# EAGLE design Shruthi-Analog-dev (EAGLE 5.09)
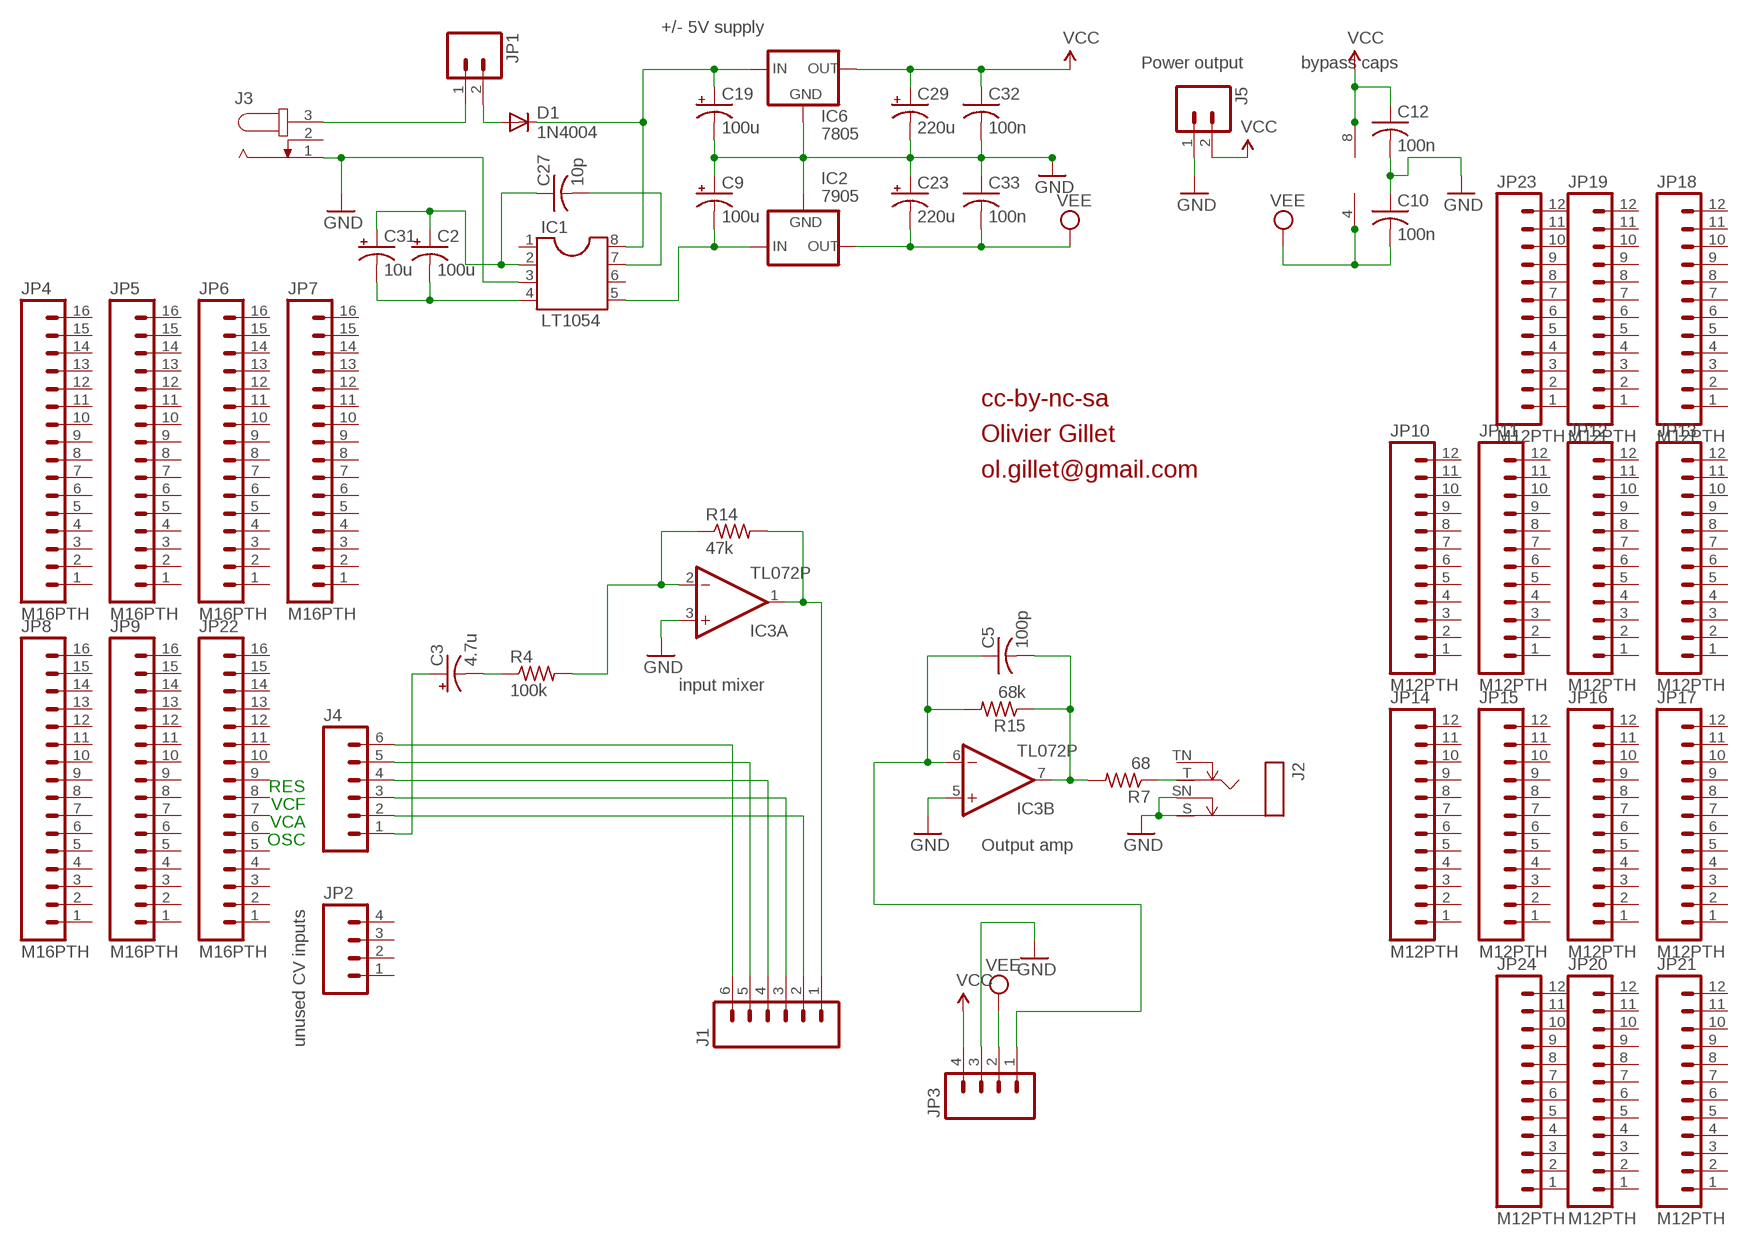
[diagram p0: schematic, sheet 1]

## Parts
C2  100u  CPOL-USE2.5-6  [E2,5-6]
C3  4.7u  CPOL-USE2.5-6  [E2,5-6]
C5  100p  C-US025-025X050  [C025-025X050]
C9  100u  CPOL-USE2.5-7  [E2,5-7]
C10  100n  C-US025-025X050  [C025-025X050]
C12  100n  C-US025-025X050  [C025-025X050]
C19  100u  CPOL-USE2.5-7  [E2,5-7]
C23  220u  CPOL-USE5-10.5  [E5-10,5]
C27  10p  C-US025-025X050  [C025-025X050]
C29  220u  CPOL-USE5-10.5  [E5-10,5]
C31  10u  CPOL-USE2.5-5  [E2,5-5]
C32  100n  C-US025-025X050  [C025-025X050]
C33  100n  C-US025-025X050  [C025-025X050]
D1  1N4004  [DO41-10]
IC1  LT1054  DIL8  [DIL08]
IC2  7905  79XXS  [79XXS]
IC3  TL072P  [DIL08]
IC6  7805  78XXS  [78XXS]
J1  M06SIP  [1X06]
J2  MONOSWS  [NMJ4HC-S]
J3  JACK-PLUG  [SPC4078_LARGER_HOLES]
J4  M06SIP  [1X06]
J5  M02PTH  [1X02]
JP1  M02  [1X02_LONGPADS]
JP2  M04PTH  [1X04]
JP3  M04PTH  [1X04]
JP4  M16PTH  [1X16]
JP5  M16PTH  [1X16]
JP6  M16PTH  [1X16]
JP7  M16PTH  [1X16]
JP8  M16PTH  [1X16]
JP9  M16PTH  [1X16]
JP10  M12PTH  [1X12]
JP11  M12PTH  [1X12]
JP12  M12PTH  [1X12]
JP13  M12PTH  [1X12]
JP14  M12PTH  [1X12]
JP15  M12PTH  [1X12]
JP16  M12PTH  [1X12]
JP17  M12PTH  [1X12]
JP18  M12PTH  [1X12]
JP19  M12PTH  [1X12]
JP20  M12PTH  [1X12]
JP21  M12PTH  [1X12]
JP22  M16PTH  [1X16]
JP23  M12PTH  [1X12]
JP24  M12PTH  [1X12]
R4  100k  R-US_0204/7  [0204/7]
R7  68  R-US_0204/7  [0204/7]
R14  47k  R-US_0204/7  [0204/7]
R15  68k  R-US_0204/7  [0204/7]

## Nets
GND: C9.+ C10.1 C12.2 C19.- C23.+ C29.- C32.2 C33.1 IC1.3 IC2.GND IC3.3(A:+IN) IC3.5(B:+IN) IC6.GND J2.S J2.SN J3.1 J5.1 JP3.3
N$1: C2.+ C27.1 C31.+ IC1.2
N$2: J1.5 J4.5
N$3: J3.3 JP1.1
N$4: C19.+ D1.C IC1.8 IC6.IN
N$5: C2.- C31.- IC1.4
N$6: J1.6 J4.6
N$7: J1.3 J4.3
N$22: IC3.1(A:OUT) J1.1 R14.2
N$35: C3.+ J4.1
N$36: C27.2 IC1.7
N$37: IC3.2(A:-IN) R4.2 R14.1
N$39: C3.- R4.1
N$45: J1.2 J4.2
N$47: J2.T R7.1
N$48: J1.4 J4.4
N$58: C9.- IC1.5 IC2.IN
N$59: D1.A JP1.2
N$63: C5.2 IC3.7(B:OUT) R7.2 R15.1
N$70: C5.1 IC3.6(B:-IN) JP3.1 R15.2
VCC: C12.1 C29.+ C32.1 IC3.8(P:V+) IC6.OUT J5.2 JP3.4
VEE: C10.2 C23.- C33.2 IC2.OUT IC3.4(P:V-) JP3.2
Unconnected: IC1.1 IC1.6 J2.TN J3.2 JP2.1 JP2.2 JP2.3 JP2.4 JP4.1 JP4.2 JP4.3 JP4.4 JP4.5 JP4.6 JP4.7 JP4.8 JP4.9 JP4.10 JP4.11 JP4.12 JP4.13 JP4.14 JP4.15 JP4.16 JP5.1 JP5.2 JP5.3 JP5.4 JP5.5 JP5.6 JP5.7 JP5.8 JP5.9 JP5.10 JP5.11 JP5.12 JP5.13 JP5.14 JP5.15 JP5.16 JP6.1 JP6.2 JP6.3 JP6.4 JP6.5 JP6.6 JP6.7 JP6.8 JP6.9 JP6.10 JP6.11 JP6.12 JP6.13 JP6.14 JP6.15 JP6.16 JP7.1 JP7.2 JP7.3 JP7.4 JP7.5 JP7.6 JP7.7 JP7.8 JP7.9 JP7.10 JP7.11 JP7.12 JP7.13 JP7.14 JP7.15 JP7.16 JP8.1 JP8.2 JP8.3 JP8.4 JP8.5 JP8.6 JP8.7 JP8.8 JP8.9 JP8.10 JP8.11 JP8.12 JP8.13 JP8.14 JP8.15 JP8.16 JP9.1 JP9.2 JP9.3 JP9.4 JP9.5 JP9.6 JP9.7 JP9.8 JP9.9 JP9.10 JP9.11 JP9.12 JP9.13 JP9.14 JP9.15 JP9.16 JP10.1 JP10.2 JP10.3 JP10.4 JP10.5 JP10.6 JP10.7 JP10.8 JP10.9 JP10.10 JP10.11 JP10.12 JP11.1 JP11.2 JP11.3 JP11.4 JP11.5 JP11.6 JP11.7 JP11.8 JP11.9 JP11.10 JP11.11 JP11.12 JP12.1 JP12.2 JP12.3 JP12.4 JP12.5 JP12.6 JP12.7 JP12.8 JP12.9 JP12.10 JP12.11 JP12.12 JP13.1 JP13.2 JP13.3 JP13.4 JP13.5 JP13.6 JP13.7 JP13.8 JP13.9 JP13.10 JP13.11 JP13.12 JP14.1 JP14.2 JP14.3 JP14.4 JP14.5 JP14.6 JP14.7 JP14.8 JP14.9 JP14.10 JP14.11 JP14.12 JP15.1 JP15.2 JP15.3 JP15.4 JP15.5 JP15.6 JP15.7 JP15.8 JP15.9 JP15.10 JP15.11 JP15.12 JP16.1 JP16.2 JP16.3 JP16.4 JP16.5 JP16.6 JP16.7 JP16.8 JP16.9 JP16.10 JP16.11 JP16.12 JP17.1 JP17.2 JP17.3 JP17.4 JP17.5 JP17.6 JP17.7 JP17.8 JP17.9 JP17.10 JP17.11 JP17.12 JP18.1 JP18.2 JP18.3 JP18.4 JP18.5 JP18.6 JP18.7 JP18.8 JP18.9 JP18.10 JP18.11 JP18.12 JP19.1 JP19.2 JP19.3 JP19.4 JP19.5 JP19.6 JP19.7 JP19.8 JP19.9 JP19.10 JP19.11 JP19.12 JP20.1 JP20.2 JP20.3 JP20.4 JP20.5 JP20.6 JP20.7 JP20.8 JP20.9 JP20.10 JP20.11 JP20.12 JP21.1 JP21.2 JP21.3 JP21.4 JP21.5 JP21.6 JP21.7 JP21.8 JP21.9 JP21.10 JP21.11 JP21.12 JP22.1 JP22.2 JP22.3 JP22.4 JP22.5 JP22.6 JP22.7 JP22.8 JP22.9 JP22.10 JP22.11 JP22.12 JP22.13 JP22.14 JP22.15 JP22.16 JP23.1 JP23.2 JP23.3 JP23.4 JP23.5 JP23.6 JP23.7 JP23.8 JP23.9 JP23.10 JP23.11 JP23.12 JP24.1 JP24.2 JP24.3 JP24.4 JP24.5 JP24.6 JP24.7 JP24.8 JP24.9 JP24.10 JP24.11 JP24.12

## Notes on the sheet
- +/- 5V supply
- Power output | bypass caps
- cc-by-nc-sa
- Olivier Gillet
- ol.gillet@gmail.com
- input mixer
- RES
- VCF
- VCA
- OSC
- Output amp
- unused CV inputs

## Library data of the parts
C2 C3 C9 C19 C23 C29 C31 = rcl:CPOL-US: POLARIZED CAPACITOR, American symbol
C5 C10 C12 C27 C32 C33 = rcl:C-US: CAPACITOR, American symbol
D1 = diode:1N4004: DIODE general purpose rectifier, 1 A
IC1 = ic-package:DIL8: Dual In Line / Socket
IC2 = v-reg:79XXS: VOLTAGE REGULATOR
IC3 = gm-ics:TL072: OP AMP
IC6 = v-reg:78XXS: VOLTAGE REGULATOR
J1 J4 = SparkFun:M06: Header 6 Standard 6-pin 0.1" header. Use with straight break away headers (SKU : PRT-00116), right angle break away headers (PRT-00553), swiss pins (PRT-00743), machine pins (PRT-00117), and female headers (PRT-00115). Molex polarized connector foot print use with SKU : PRT-08094 with associated crimp pins and housings. NOTES ON THE VARIANTS LOCK and LOCK_LONGPADS... This footprint was designed to help hold the alignment of a through-hole component (i.e. 6-pin header) while soldering it into place. You may notice that each hole has been shifted either up or down by 0.005 of an inch from it's more standard position (which is a perfectly straight line). This slight alteration caused the pins (the squares in the middle) to touch the edges of the holes. Because they are alternating, it causes a "brace" to hold the component in place. 0.005 has proven to be the perfect amount of "off-center" position when using our standard breakaway headers. Although looks a little odd when you look at the bare footprint, once you have a header in there, the alteration is very hard to notice. Also, if you push a header all the way into place, it is covered up entirely on the bottom side. This idea of altering the position of holes to aid alignment will be further integrated into the Sparkfun Library for other footprints. It can help hold any component with 3 or more connection pins.
J2 = gm-jacks:MONOSW
J3 = con-jack2:JACK-PLUG: DC POWER JACK Power Jack, DC, Right Angle, Through Hole, Rated 5A at 16VDC, PC Terminals Distributor: Farnell (www.Farnell.de) Drawing: 84N1161.pdf / 84N1162.pdf Manufacturer: SPC Technology (www.spctechnology.com) Type: SPC4077 / SPC 4078
J5 JP1 = SparkFun:M02: Header 2 Standard 2-pin 0.1" header. Use with straight break away headers (SKU : PRT-00116), right angle break away headers (PRT-00553), swiss pins (PRT-00743), machine pins (PRT-00117), and female headers (PRT-00115). Molex polarized connector foot print use with SKU : PRT-08233 with associated crimp pins and housings.
JP2 JP3 = SparkFun:M04: Header 4 Standard 4-pin 0.1" header. Use with straight break away headers (SKU : PRT-00116), right angle break away headers (PRT-00553), swiss pins (PRT-00743), machine pins (PRT-00117), and female headers (PRT-00115). Molex polarized connector foot print use with SKU : PRT-08231 with associated crimp pins and housings.
JP4-JP9 JP22 = SparkFun:M16
JP10-JP21 JP23 JP24 = SparkFun:M12: Header 12 Standard 12-pin 0.1" header. Use with straight break away headers (SKU : PRT-00116), right angle break away headers (PRT-00553), swiss pins (PRT-00743), machine pins (PRT-00117), and female headers (PRT-00115).
R4 R7 R14 R15 = rcl:R-US_: RESISTOR, American symbol

## Board
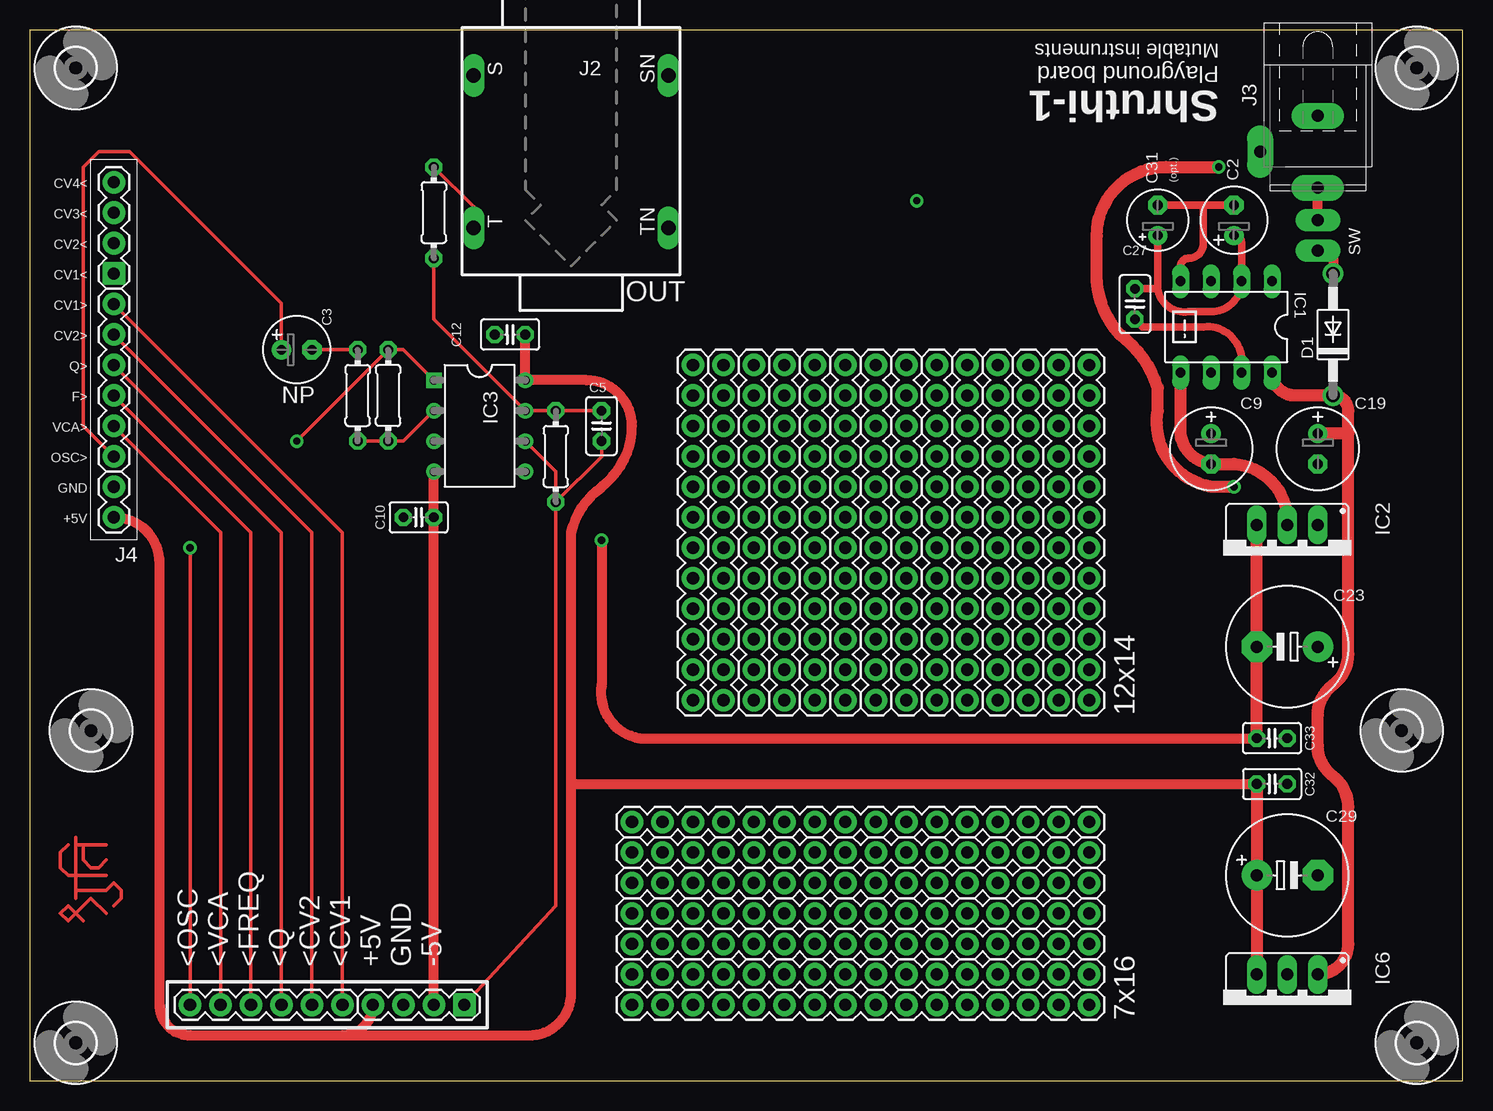
[diagram p1: board, top side]
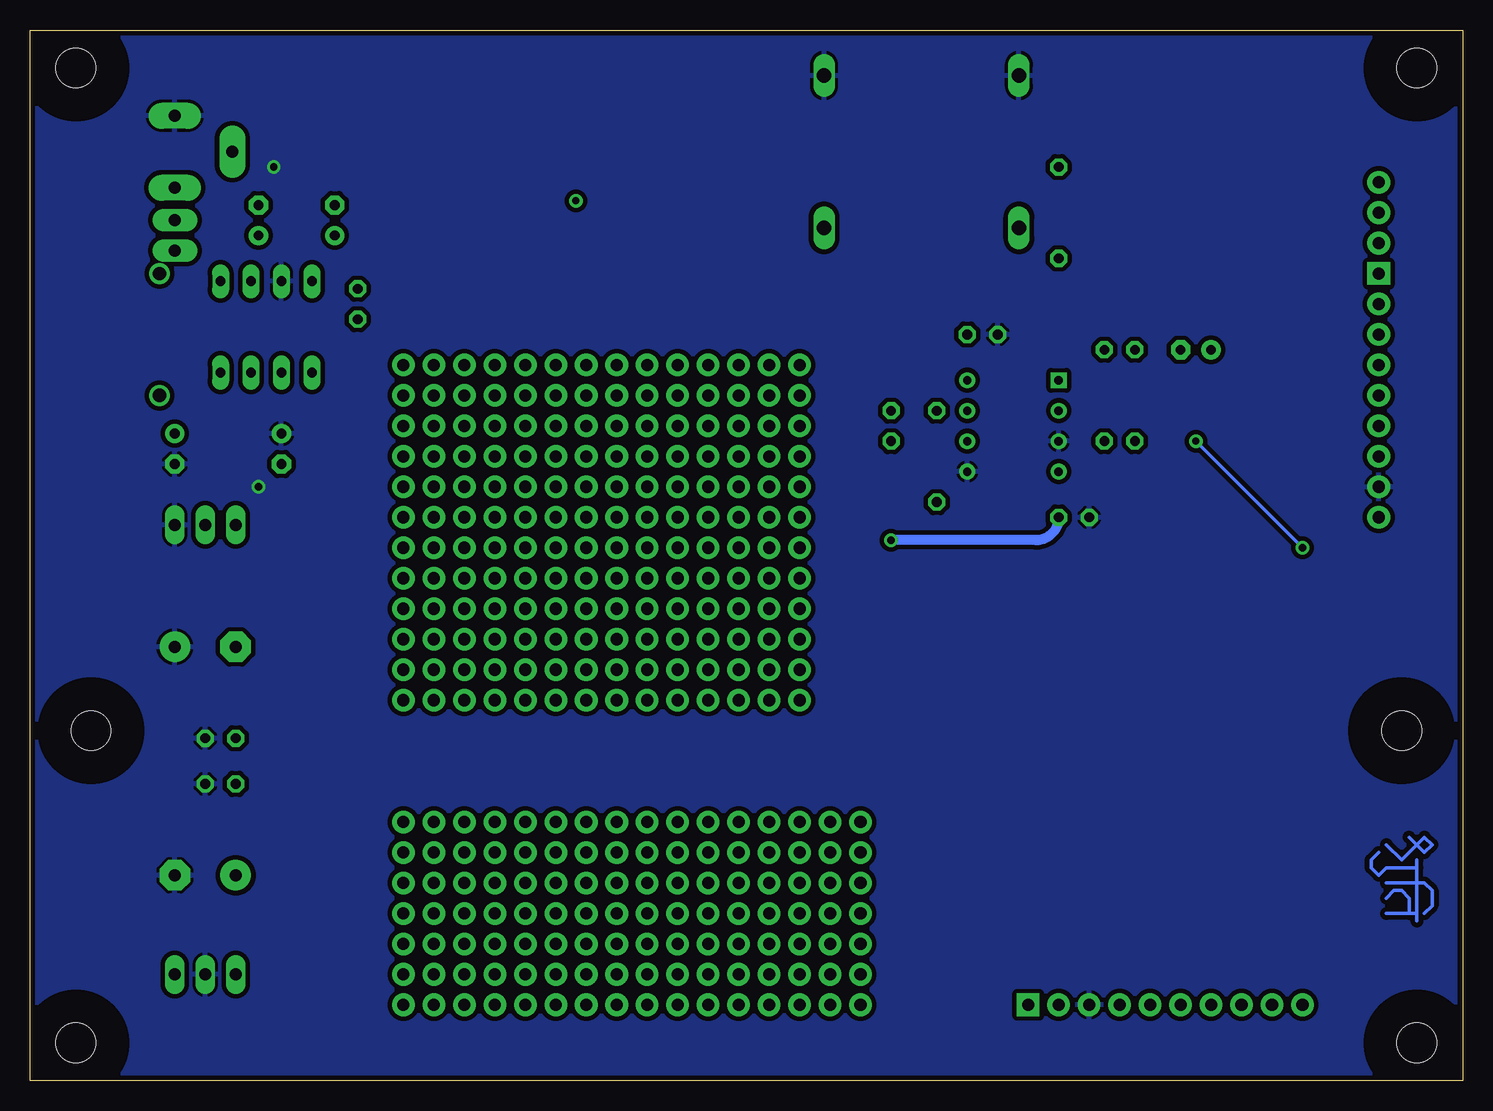
[diagram p2: board, bottom side, seen from below]

Size 119.38 x 87.62 mm. Coordinates in mm from the lower left corner, seen from the top.
Outline: 0,0 119.38,0 119.38,87.62 0,87.62 0,0
Copper layers (1*16): Top 0.035mm / dielectric 1.5mm / Bottom 0.035mm
Design rules "SparkFun_10mil": minimum track width 10mil, minimum drill 20mil, track to track 10mil, track to pad 10mil, pad to pad 10mil, via to via 10mil, smd to smd 10mil, copper to edge 10mil, drill to drill 10mil, minimum pad ring 12mil, minimum via ring 10mil, stop-mask expansion 4mil, vias tented up to drill 25mil, thermal gap 10mil

### Footprints (pad centres in the part's own frame; a part is rotated, then mirrored left to right if it is on the bottom)
E2,5-6 = drill 0.813 pad 1.6 round: + -1.27,0 | drill 0.813 pad 1.6 octagon: - 1.27,0
C025-025X050 = drill 0.813 octagon: 1 -1.27,0; 2 1.27,0
E2,5-7 = drill 0.813 pad 1.6 round: + -1.27,0 | drill 0.813 pad 1.6 octagon: - 1.27,0
E5-10,5 = drill 1.016 pad 2.54 round: + -2.54,0 | drill 1.016 pad 2.54 octagon: - 2.54,0
E2,5-5 = drill 0.813 pad 1.6 round: + -1.27,0 | drill 0.813 pad 1.6 octagon: - 1.27,0
DO41-10 = drill 1.118 round: A 5.08,0; C -5.08,0
DIL08 = drill 0.813 long: 1 -3.81,-3.81; 2 -1.27,-3.81; 3 1.27,-3.81; 4 3.81,-3.81; 5 3.81,3.81; 6 1.27,3.81; 7 -1.27,3.81; 8 -3.81,3.81
79XXS = drill 1.016 long: GND -2.54,-2.54; IN 0,-2.54; OUT 2.54,-2.54
DIL08' = drill 0.7 square: 1 -3.81,-3.81 | drill 0.7 round: 2 -1.27,-3.81; 3 1.27,-3.81; 4 3.81,-3.81; 5 3.81,3.81; 6 1.27,3.81; 7 -1.27,3.81; 8 -3.81,3.81
78XXS = drill 1.016 long: GND 0,-2.54; IN -2.54,-2.54; OUT 2.54,-2.54
1X06 = drill 1.016 pad 1.88 round: 1 0,0; 2 2.54,0; 3 5.08,0; 4 7.62,0; 5 10.16,0; 6 12.7,0
NMJ4HC-S = drill 1.2 long: S 5.08,8.115; SN 5.08,-8.115; T -7.62,8.115; TN -7.62,-8.115
SPC4078_LARGE_HOLES = drill 1 pad 2.184 long: 1 -3,0; 2 0,-4.8; 3 3,0
1X02 = drill 1.016 pad 1.88 round: 1 0,0; 2 2.54,0
1X02_LONGPADS = drill 1.016 pad 1.88 long: 1 0,0; 2 2.54,0
1X04 = drill 1.016 pad 1.88 square: 1 0,0 | drill 1.016 pad 1.88 round: 2 2.54,0; 3 5.08,0; 4 7.62,0
1X16 = drill 1.016 pad 1.88 round: 1 0,0; 2 2.54,0; 3 5.08,0; 4 7.62,0; 5 10.16,0; 6 12.7,0; 7 15.24,0; 8 17.78,0; 9 20.32,0; 10 22.86,0; 11 25.4,0; 12 27.94,0; 13 30.48,0; 14 33.02,0; 15 35.56,0; 16 38.1,0
1X12 = drill 1.016 pad 1.88 round: 1 0,0; 2 2.54,0; 3 5.08,0; 4 7.62,0; 5 10.16,0; 6 12.7,0; 7 15.24,0; 8 17.78,0; 9 20.32,0; 10 22.86,0; 11 25.4,0; 12 27.94,0
0204/7 = drill 0.813 octagon: 1 -3.81,0; 2 3.81,0
3,3 = hole 3.3: 0,0

### Placement (x,y rotation side)
C2  100.33,71.75 90 top
C3  22.23,60.96 0 top
C5  47.62,54.61 90 top
C9  98.42,52.71 270 top
C10  32.38,46.99 0 top
C12  40.01,62.23 180 top
C19  107.31,52.71 270 top
C23  104.78,36.2 180 top
C27  92.08,64.77 270 top
C29  104.78,17.14 0 top
C31  93.98,71.75 90 top
C32  103.5,24.76 0 top
C33  103.5,28.57 180 top
D1  108.58,62.23 90 top
IC1  99.69,62.87 180 top
IC2  104.78,43.82 180 top
IC3  TL072P  [DIL08']  37.47,54.61 270 top
IC6  104.78,6.35 180 top
J1  13.34,6.35 0 top
J2  45.09,78.74 90 top
J3  [SPC4078_LARGE_HOLES]  107.31,77.47 270 top
J4  6.99,52.07 90 top
J5  6.99,49.53 270 top
JP1  107.31,71.75 270 top
JP2  6.99,67.31 90 top
JP3  36.2,6.35 180 top
JP4  50.16,21.59 0 top
JP5  50.16,19.05 0 top
JP6  50.16,16.51 0 top
JP7  50.16,13.97 0 top
JP8  50.16,11.43 0 top
JP9  50.16,8.89 0 top
JP10  62.87,31.75 90 top
JP11  65.41,31.75 90 top
JP12  67.95,31.75 90 top
JP13  70.48,31.75 90 top
JP14  73.03,31.75 90 top
JP15  75.56,31.75 90 top
JP16  78.11,31.75 90 top
JP17  80.64,31.75 90 top
JP18  83.19,31.75 90 top
JP19  85.72,31.75 90 top
JP20  60.33,31.75 90 top
JP21  88.27,31.75 90 top
JP22  50.16,6.35 0 top
JP23  57.78,31.75 90 top
JP24  55.24,31.75 90 top
R4  27.3,57.15 270 top
R7  33.66,72.39 270 top
R14  29.84,57.15 90 top
R15  43.81,52.07 270 top
U$1  [3,3]  3.81,84.45 0 top
U$2  [3,3]  115.57,84.45 0 top
U$3  [3,3]  5.08,29.21 0 top
U$4  [3,3]  114.3,29.21 0 top
U$5  [3,3]  3.81,3.17 0 top
U$6  [3,3]  115.57,3.17 0 top

### Tracks (layer width: path | path; a pad name or v marks a point on that pad's centre or on a via)
GND  (via drill 0.6)
  Top 1.016: v99.06,76.2 94.65,76.2 arc90 88.9,70.45 88.9,66.67 arc37 90.8,62.23 arc-37 93.98,57.79 93.98,55.88 arc90 98.42,49.53 v100.33,49.53
  pour Bottom (isolate 0.381): 0.64,87 0.64,0.64 118.75,0.64 118.75,87
N$1
  Top 0.61: C2.+ arc-90 100.97,69.85 IC1.2 arc-90 98.42,64.14 96.52,64.14 arc-90 93.98,66.04 | 93.98,66.04 C31.+ | C27.1 93.98,66.04
N$2
  Top 0.305: J4.5 23.5,45.72 J1.5
N$3
  Top 0.813: JP1.1 J3.3
N$4
  Top 1.016: IC6.IN arc90 109.86,11.43 109.86,22.86 arc53 108.58,25.4 arc-53 107.31,27.94 107.31,30.48 arc-53 108.58,33.02 arc53 109.86,35.56 109.86,53.98 | 109.86,53.98 109.86,55.88 arc90 D1.C 105.41,57.15 arc-90 IC1.8 | 109.86,53.98 C19.+
N$5
  Top 0.61: 97.79,73.03 C31.- | 97.79,73.03 C2.- | IC1.4 95.89,67.95 arc-90 96.52,68.58 arc90 97.79,69.85 97.79,73.03
N$6
  Top 0.305: J4.6 26.04,45.72 J1.6
N$7
  Top 0.305: J4.3 18.41,45.72 J1.3
N$15
  Bottom 0.305: 6.35,19.68 5.08,18.41 3.18,20.32 2.54,19.68 3.18,19.05 4.45,20.32
N$22  (via drill 0.6)
  Top 0.305: J1.1 v13.34,44.45 | v22.23,53.34 R14.2 31.11,60.96 IC3.1
  Bottom 0.305: v13.34,44.45 v22.23,53.34
N$35
  Top 0.305: J4.1 4.45,54.61 4.45,76.2 5.71,77.47 8.33,77.47 20.96,64.84 C3.+
N$36
  Top 0.61: IC1.7 100.97,60.33 arc90 97.79,62.87 92.71,62.87 C27.2
N$37
  Top 0.305: R4.2 R14.1 31.11,53.34 IC3.2
N$39
  Top 0.305: C3.- R4.1
N$45
  Top 0.305: J4.2 15.88,45.72 J1.2
N$47
  Top 0.305: R7.1 36.97,72.89 J2.T
N$48
  Top 0.305: J4.4 20.96,45.72 J1.4
N$52
  Bottom 0.305: 3.81,17.78 3.81,18.41 | 3.81,16.51 3.81,17.78 | 3.81,13.97 3.81,16.51 | 3.81,13.34 3.81,13.97 | 4.45,13.97 6.35,13.97 | 3.81,13.97 4.45,13.97 | 4.45,13.97 4.45,15.24 5.08,15.88 5.71,15.88 6.35,15.24 | 3.81,17.78 6.35,17.78 6.99,17.14 7.62,17.78 7.62,18.41 6.99,19.05 | 3.81,16.51 6.35,16.51 | 3.81,16.51 3.18,16.51 2.54,15.88 2.54,14.61 3.18,13.97
N$53
  Top 0.305: 6.35,13.97 5.08,15.24 3.18,13.34 2.54,13.97 3.18,14.61 4.45,13.34
N$54
  Top 0.305: 3.81,15.88 3.81,15.24 | 3.81,15.88 3.81,17.14 | 3.81,17.14 3.81,19.68 | 3.81,19.68 3.81,20.32 | 4.45,19.68 6.35,19.68 | 3.81,19.68 4.45,19.68 | 4.45,19.68 4.45,18.41 5.08,17.78 5.71,17.78 6.35,18.41 | 3.81,15.88 6.35,15.88 6.99,16.51 7.62,15.88 7.62,15.24 6.99,14.61 | 3.81,17.14 6.35,17.14 | 3.81,17.14 3.18,17.14 2.54,17.78 2.54,19.05 3.18,19.68
N$58
  Top 1.016: IC1.5 95.89,54.61 arc90 C9.- 100.33,51.44 arc-90 IC2.IN
N$59
  Top 0.813: JP1.2 arc-90 108.58,68.58 D1.A
N$62  (via drill 0.6)
  other vias: 73.89,73.38
N$63
  Top 0.305: C5.2 R15.1 IC3.7 33.66,63.5 R7.2
N$70
  Top 0.305: C5.1 47.62,52.07 R15.2 | JP3.1 43.81,14.61 R15.2 | IC3.6 43.81,50.8 R15.2
VCC
  Top 0.61: IC6.OUT C29.+
  Top 0.813: C12.1 IC3.8 46.35,58.42 arc-90 50.16,54.61 arc-53 47.62,49.53 arc39 45.09,45.72 45.09,24.76 | 45.09,24.76 45.09,7.62 arc-90 41.91,3.81 26.04,3.81 | 26.04,3.81 13.34,3.81 arc-90 10.79,6.35 10.79,43.18 arc90 J5.2 | 26.04,3.81 arc90 JP3.4 | 45.09,24.76 C32.1
  Top 1.016: C32.1 IC6.OUT
VEE  (via drill 0.6)
  Top 0.813: IC3.4 C10.2 JP3.2 | C33.2 50.8,28.57 arc-90 47.62,33.02 v47.62,45.09
  Top 1.016: C33.2 C23.- IC2.OUT
  Bottom 0.813: v47.62,45.09 35.56,45.09 arc-90 C10.2

### Text on the board
tPlace: Mutable instruments | CV4< | CV3< | CV2< | CV1< | CV1> | CV2> | Q> | F> | VCA> | OSC> | GND | +5V | 12x14 | 7x16
tNames: Playground board | Shruthi-1 | (opt.) | SW | OUT | NP | <OSC | <VCA | <FREQ | <Q | <CV2 | <CV1 | +5V | GND | -5V